# Altium schematic sheet Sheet_1_2022-01-12.schdoc
size 57 x 37 mm
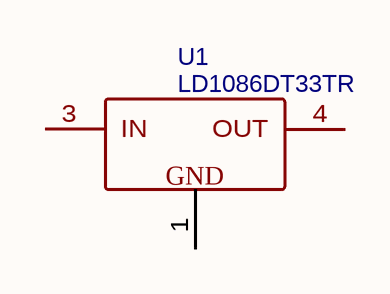
[diagram p0: Sheet_1_2022-01-12.schdoc]

## Parts
U1  LD1086DT33TR  [TO-252-2_L6.5-W6.1-P4.58-LS10.0-TL]

## Nets

Not connected (* = marked no-connect by the designer): U1 1(GND) 3(IN) 4(OUT)

## Library data of the parts
U1 = LD1086DT33TR: BOM_Manufacturer: STMicroelectronics; BOM_Supplier: LCSC; BOM_Manufacturer Part: LD1086DT33TR; BOM_Supplier Part: C12051; BOM_JLCPCB Part Class: Extended Part; spicePre: U; spiceSymbolName: LD1086DT33TR